# Altium schematic sheet ADC.SchDoc: ADC
size OrCAD A; DocumentNumber: LM-003; Revision: 3.0; SheetNumber: 3; SheetTotal: 11
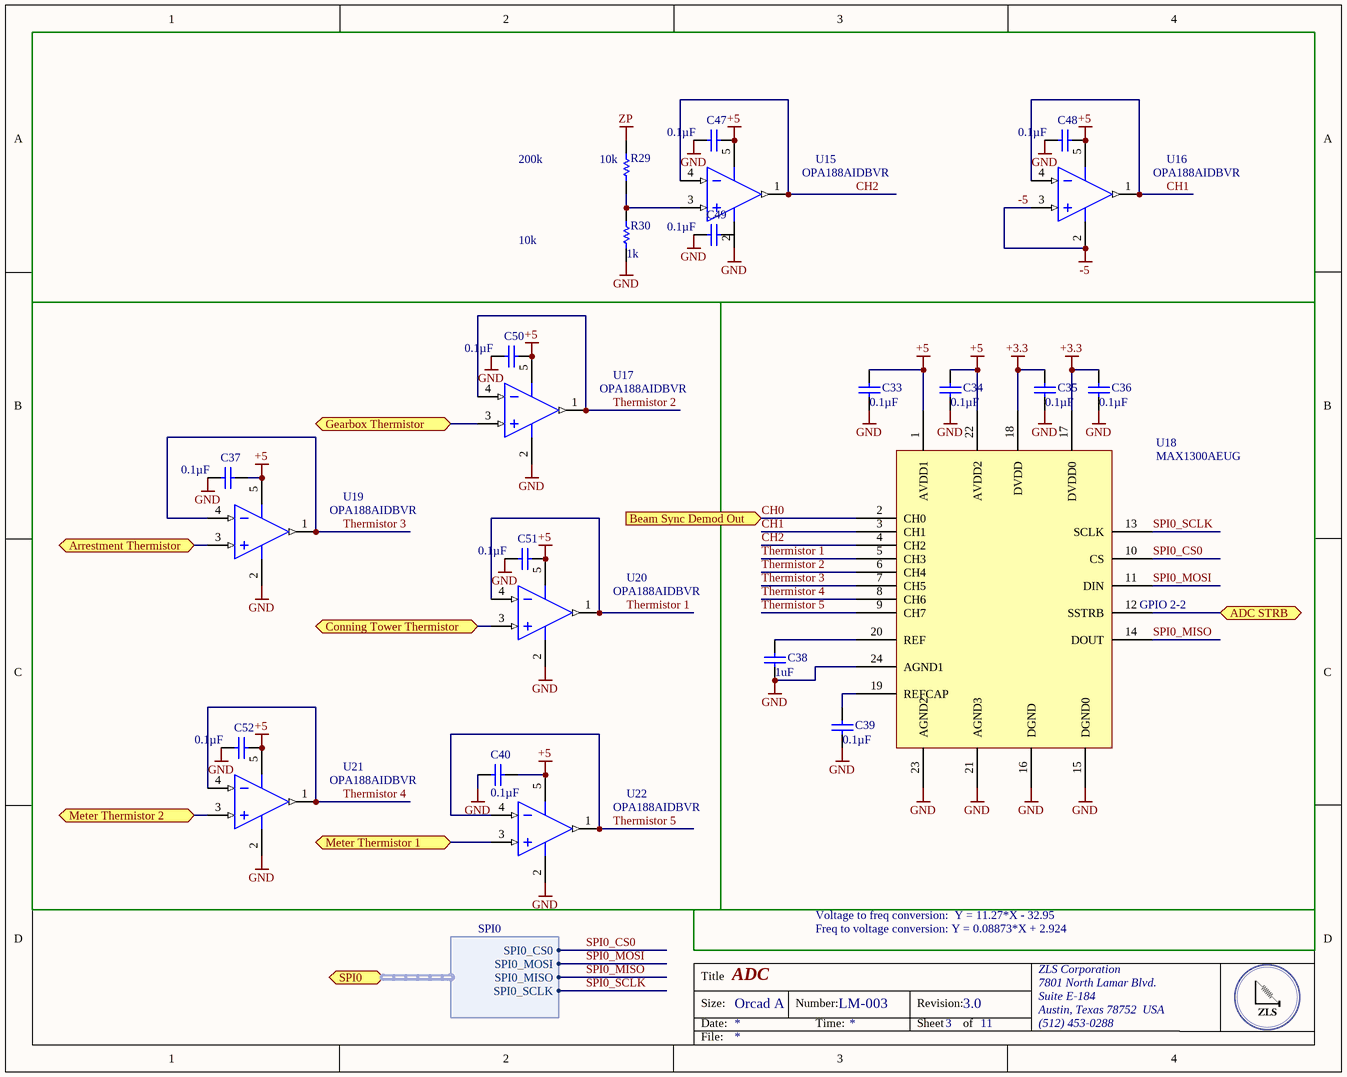
[diagram p0: ADC.SchDoc]

## Parts
C33  Capacitance: 0.1µF  [CAPC0805(2012)145_N]  (hidden comment: CAP CER 0.1UF 25V X7R 0805)
C34  Capacitance: 0.1µF  [CAPC0805(2012)145_N]  (hidden comment: CAP CER 0.1UF 25V X7R 0805)
C35  Capacitance: 0.1µF  [CAPC0805(2012)145_N]  (hidden comment: CAP CER 0.1UF 25V X7R 0805)
C36  Capacitance: 0.1µF  [CAPC0805(2012)145_N]  (hidden comment: CAP CER 0.1UF 25V X7R 0805)
C37  Capacitance: 0.1µF  [CAPC0805(2012)145_N]  (hidden comment: CAP CER 0.1UF 16V X7R 0805)
C38  Capacitance: 1uF  [CAPC0805(2012)145_N]  (hidden comment: CAP CER 1UF 16V X7R 0805)
C39  Capacitance: 0.1µF  [CAPC0805(2012)145_N]  (hidden comment: CAP CER 0.1UF 16V X7R 0805)
C40  Capacitance: 0.1µF  [CAPC0805(2012)145_N]  (hidden comment: CAP CER 0.1UF 16V X7R 0805)
C47  Capacitance: 0.1µF  [CAPC0805(2012)145_N]  (hidden comment: CAP CER 0.1UF 16V X7R 0805)
C48  Capacitance: 0.1µF  [CAPC0805(2012)145_N]  (hidden comment: CAP CER 0.1UF 16V X7R 0805)
C49  Capacitance: 0.1µF  [CAPC0805(2012)145_N]  (hidden comment: CAP CER 0.1UF 16V X7R 0805)
C50  Capacitance: 0.1µF  [CAPC0805(2012)145_N]  (hidden comment: CAP CER 0.1UF 16V X7R 0805)
C51  Capacitance: 0.1µF  [CAPC0805(2012)145_N]  (hidden comment: CAP CER 0.1UF 16V X7R 0805)
C52  Capacitance: 0.1µF  [CAPC0805(2012)145_N]  (hidden comment: CAP CER 0.1UF 16V X7R 0805)
R29  Resistance (Ohms): 10k  [RESC0805(2012)_M]  (hidden comment: RES SMD 10K OHM 1% 1/8W 0805)
R30  Resistance (Ohms): 1k  [RESC0805(2012)_M]  (hidden comment: RES SMD 1K OHM 1% 1/8W 0805)
U15  OPA188AIDBVR  [DBV0005A_M]
U16  OPA188AIDBVR  [DBV0005A_M]
U17  OPA188AIDBVR  [DBV0005A_M]
U18  MAX1300AEUG  [TSOP65P640X90-24N]
U19  OPA188AIDBVR  [DBV0005A_M]
U20  OPA188AIDBVR  [DBV0005A_M]
U21  OPA188AIDBVR  [DBV0005A_M]
U22  OPA188AIDBVR  [DBV0005A_M]

## Blocks framed on the sheet
GPIO 2-2: C33-C36 C38 C39 U18

## Ports
ADC STRB, Arrestment Thermistor, Beam Sync Demod Out (in), Conning Tower Thermistor, Gearbox Thermistor, Meter Thermistor 1, Meter Thermistor 2, SPI0 (harness SPI0)

## Harnesses
SPI0: SPI0_CS0, SPI0_MOSI, SPI0_MISO, SPI0_SCLK

## Nets
+3.3: C35.1 C36.1 U18.17(DVDD0) U18.18(DVDD)
+5: C33.1 C34.1 C37.2 C40.2 C47.2 C48.2 C50.2 C51.2 C52.2 U15.5(V+) U16.5(V+) U17.5(V+) U18.1(AVDD1) U18.22(AVDD2) U19.5(V+) U20.5(V+) U21.5(V+) U22.5(V+)
-5: U16.2(V-) U16.3(IN+)
GND: C33.2 C34.2 C35.2 C36.2 C37.1 C38.2 C39.2 C40.1 C47.1 C48.1 C49.1 C50.1 C51.1 C52.1 R30.1 U15.2(V-) U17.2(V-) U18.15(DGND0) U18.16(DGND) U18.21(AGND3) U18.23(AGND2) U18.24(AGND1) U19.2(V-) U20.2(V-) U21.2(V-) U22.2(V-)
ZP: R29.2
ADC STRB: U18.12(SSTRB) ; port ADC STRB
Arrestment Thermistor: U19.3(IN+) ; port Arrestment Thermistor
CH0: U18.2(CH0) ; port Beam Sync Demod Out
CH1: U16.1(OUT) U16.4(IN-) U18.3(CH1)
CH2: U15.1(OUT) U15.4(IN-) U18.4(CH2)
Conning Tower Thermistor: U20.3(IN+) ; port Conning Tower Thermistor
Gearbox Thermistor: U17.3(IN+) ; port Gearbox Thermistor
Meter Thermistor 1: U22.3(IN+) ; port Meter Thermistor 1
Meter Thermistor 2: U21.3(IN+) ; port Meter Thermistor 2
SPI0_CS0: U18.10(CS) ; port SPI0.SPI0_CS0
SPI0_MISO: U18.14(DOUT) ; port SPI0.SPI0_MISO
SPI0_MOSI: U18.11(DIN) ; port SPI0.SPI0_MOSI
SPI0_SCLK: U18.13(SCLK) ; port SPI0.SPI0_SCLK
Thermistor 1: U18.5(CH3) U20.1(OUT) U20.4(IN-)
Thermistor 2: U17.1(OUT) U17.4(IN-) U18.6(CH4)
Thermistor 3: U18.7(CH5) U19.1(OUT) U19.4(IN-)
Thermistor 4: U18.8(CH6) U21.1(OUT) U21.4(IN-)
Thermistor 5: U18.9(CH7) U22.1(OUT) U22.4(IN-)
NetC38_1: C38.1 U18.20(REF)
NetC39_1: C39.1 U18.19(REFCAP)
NetR29_1: R29.1 R30.2 U15.3(IN+)

Not connected (* = marked no-connect by the designer): C49 2

## Notes on the sheet
- 200k
- 10k
- Freq to voltage conversion: Y = 0.08873*X + 2.924
- Voltage to freq conversion:  Y = 11.27*X - 32.95
- Title
- Size:
- Date:
- Orcad A
- Number:
- Time:
- Revision:
- Sheet
- of
- ZLS Corporation
- 7801 North Lamar Blvd.
- Suite E-184
- Austin, Texas 78752  USA
- (512) 453-0288
- File:

## Library data of the parts
C33-C36 = CMP-1036-04795-1: Manufacturer: Murata Electronics North America; Manufacturer Part Number: GRM21BR71E104KA01L; Tolerance: ±10%; Supplier 1: Digi-Key; Supplier Part Number 1: 490-1673-6-ND; RoHS: RoHS Compliant; Category: Capacitors; Stock 1: 891652; Pricing 1: 1=0.2, 10=0.145, 100=0.0683, 500=0.04788, 1000=0.03964 (USD); Packaging: Digi-Reel®; Part Status: Active; Voltage - Rated: 25V; Temperature Coefficient: X7R; Operating Temperature: -55°C ~ 125°C; Features: -; Ratings: -; Applications: General Purpose; Mounting Type: Surface Mount, MLCC; Package / Case: 0805 (2012 Metric); Size / Dimension: 0.079" L x 0.049" W (2.00mm x 1.25mm); Height - Seated (Max): -; Thickness (Max): 0.053" (1.35mm); Lead Spacing: -; Lead Style: -; ComponentLink1URL: http://www.murata.com/~/media/webrenewal/support/library/catalog/products/capacitor/mlcc/c02e.ashx; ComponentLink1Description: http://www.murata.com/~/media/webrenewal/support/library/catalog/products/capacitor/mlcc/c02e.ashx
C37 C39 C40 C47-C52 = CMP-1036-04795-1: Manufacturer: Murata Electronics North America; Manufacturer Part Number: GRM219R71C104KA01D; Tolerance: ±10%; Voltage - Rated: 25V; Supplier Part Number 1: 490-1673-6-ND; Temperature Coefficient: X7R; Thickness (Max): 0.053" (1.35mm); Supplier 2: Digi-Key; Supplier Part Number 2: 490-1683-6-ND; RoHS: RoHS Compliant; Category: Capacitors; Stock 2: 245331; Pricing 2: 1=0.14, 10=0.098, 100=0.0462, 500=0.0324, 1000=0.02683 (USD); Packaging: Digi-Reel®; Part Status: Active; Operating Temperature: -55°C ~ 125°C; Features: -; Ratings: -; Applications: General Purpose; Mounting Type: Surface Mount, MLCC; Package / Case: 0805 (2012 Metric); Size / Dimension: 0.079" L x 0.049" W (2.00mm x 1.25mm); Height - Seated (Max): -; Lead Spacing: -; Lead Style: -; ComponentLink1URL: http://www.murata.com/~/media/webrenewal/support/library/catalog/products/capacitor/mlcc/c02e.ashx; ComponentLink1Description: http://www.murata.com/~/media/webrenewal/support/library/catalog/products/capacitor/mlcc/c02e.ashx
C38 = CMP-1036-04795-1: Manufacturer: Kemet; Manufacturer Part Number: C0805X105K4RACTU; Dielectric Material: Ceramic; Tolerance: 10%; Dissipation Factor: 3.5%; Supplier 1: Digi-Key; Supplier Part Number 1: 399-5329-1-ND; Stock 1: 12821; Pricing 1: 1=0.72, 10=0.528, 100=0.3623, 500=0.2868, 1000=0.2415 (USD); Mount: Surface Mount; Case/Package: 0805; Case Code (Imperial): 0805; Case Code (Metric): 2012; Min Operating Temperature: -55°C; Max Operating Temperature: 125°C; Packaging: Tape and Reel; Voltage Rating (DC): 16V; Package Quantity: 1; Voltage Rating: 16V; Dielectric: X7R; Termination: SMD/SMT; Voltage: 16V; Length: 2.1mm; Height: 0.9mm; Width: 1.25mm; Thickness: 0.039inch; Depth: 1.25mm; Radiation Hardening: No; REACH SVHC: No SVHC; ComponentLink1URL: https://datasheet.ciiva.com/7842/1698763-7842475.pdf; ComponentLink1Description: https://datasheet.ciiva.com/7842/1698763-7842475.pdf; ComponentLink2URL: https://datasheet.ciiva.com/7842/1698763-7842476.pdf; ComponentLink2Description: https://datasheet.ciiva.com/7842/1698763-7842476.pdf; ComponentLink3URL: https://datasheet.ciiva.com/14593/70096394-14593295.pdf; ComponentLink3Description: https://datasheet.ciiva.com/14593/70096394-14593295.pdf
R29 = CMP-1013-00017-1: Manufacturer: Vishay Dale; Manufacturer Part Number: CRCW080510K0FKTA; Power (Watts): 0.125W, 1/8W; Temperature Coefficient: ±100ppm/°C; Supplier 1: Digi-Key; Supplier Part Number 1: 541-3016-6-ND; RoHS: RoHS non-compliant; Category: Resistors; Stock 1: 5348; Pricing 1: 1=0.14, 10=0.129, 100=0.0496, 1000=0.02183, 2500=0.01885 (USD); Packaging: Digi-Reel®; Part Status: Active; Tolerance: ±1%; Composition: Thick Film; Features: Automotive AEC-Q200; Operating Temperature: -55°C ~ 155°C; Package / Case: 0805 (2012 Metric); Supplier Device Package: 0805; Size / Dimension: 0.079" L x 0.049" W (2.00mm x 1.25mm); Height - Seated (Max): 0.020" (0.50mm); Failure Rate: -; ComponentLink1URL: http://www.vishay.com/docs/20008/dcrcw.pdf; ComponentLink1Description: http://www.vishay.com/docs/20008/dcrcw.pdf
R30 = CMP-1013-00017-1: Manufacturer: Vishay Dale; Manufacturer Part Number: CRCW08051K00FKTA; Power (Watts): 0.125W, 1/8W; Temperature Coefficient: ±100ppm/°C; Supplier 1: Digi-Key; Supplier Part Number 1: 541-1.00KAWDKR-ND; RoHS: RoHS non-compliant; Category: Resistors; Stock 1: 57884; Pricing 1: 1=0.14, 10=0.129, 100=0.0496, 1000=0.02183, 2500=0.01885 (USD); Packaging: Digi-Reel®; Part Status: Active; Tolerance: ±1%; Composition: Thick Film; Features: Automotive AEC-Q200; Operating Temperature: -55°C ~ 155°C; Package / Case: 0805 (2012 Metric); Supplier Device Package: 0805; Size / Dimension: 0.079" L x 0.049" W (2.00mm x 1.25mm); Height - Seated (Max): 0.020" (0.50mm); Failure Rate: -; ComponentLink1URL: http://www.vishay.com/docs/20008/dcrcw.pdf; ComponentLink1Description: http://www.vishay.com/docs/20008/dcrcw.pdf
U15-U17 U19-U22 = CMP-0809-00005-2: Precision, Low Noise, Rail-to-Rail Output, Zero-Drift Operational Amplifier, 4 to 36 V, -40 to 125 degC, 5-pin SOT23 (DBV5), Green (RoHS & no Sb/Br); Manufacturer: Texas Instruments; Total Supply Voltage(Min)(+5V is 5, +/-5V is 10): 4; Offset Drift(Typ)(uV/C): 0.03; Rating: Catalog; SubFamily: Zero Drift Precision Amplifier; GBW(Typ)(MHz): 2; Slew Rate(Typ)(V/us): 0.8; Number of Channels: 1; CMRR(Min)(dB): 120; Iq per channel(Max)(mA): 0.51; Total Supply Voltage(Max)(+5V is 5, +/-5V is 10): 36; PartNumber: OPA188AIDBVR; ComponentLink2Description: Datasheet; ComponentLink2URL: http://www.ti.com/lit/ds/symlink/opa188.pdf; ComponentLink1Description: Manufacturer URL; Mounting Technology: Surface Mount; Eco-Plan: Green (RoHS & no Sb/Br); ComponentLink1URL: http://www.ti.com/; PackageVersion: 4073253-4/K, 03/2006; DatasheetVersion: SBOS642A; ComponentLink3Description: Package Specification; PackageReference: DBV0005A; ComponentLink3URL: http://www.ti.com/litv/pdf/mpds018i; PackageDescription: 5-Pin Plastic Small Outline, Body 1.6 x 2.9 mm, Pitch 0.95 mm; Code_JEDEC: MO-178
U18 = MAX1300AEUG: IC ADC 16BIT SRL 115KSPS 24TSSOP; Manufacturer 1: Maxim Integrated; Manufacturer Part Number 1: MAX1300AEUG+; Category 1: Integrated Circuits (ICs); Number of Bits: 16; Sampling Rate (Per Second): 115k; Number of Inputs: 4, 8; Input Type: Differential, Single Ended; Data Interface: SPI; Configuration: MUX-PGA-S/H-ADC; Ratio - S/H:ADC: 1:1; Number of A/D Converters: 1; Architecture: SAR; Reference Type: External, Internal; Voltage - Supply, Analog: 5V; Supplier 2: Mouser; Supplier Part Number 2: 700-MAX1300AEUG+; Supplier 1: Digi-Key; Supplier Part Number 1: MAX1300AEUG+-ND; RoHS 1: RoHS Compliant; Description 1: IC ADC 16BIT SRL 115KSPS 24TSSOP; Stock 1: 1553; Pricing 1: 1=13.94, 10=13.24, 50=13.16 (USD); Packaging: Tube; Part Status: Active; Voltage - Supply, Digital: 5V; Features: PGA; Operating Temperature: -40°C ~ 85°C; Package / Case: 24-TSSOP (0.173", 4.40mm Width); Supplier Device Package: 24-TSSOP; ComponentLink1URL: http://datasheets.maximintegrated.com/en/ds/MAX1300-MAX1301.pdf; ComponentLink1Description: http://datasheets.maximintegrated.com/en/ds/MAX1300-MAX1301.pdf